# EAGLE schematic stm32 v0.9 (EAGLE 9.6.2)
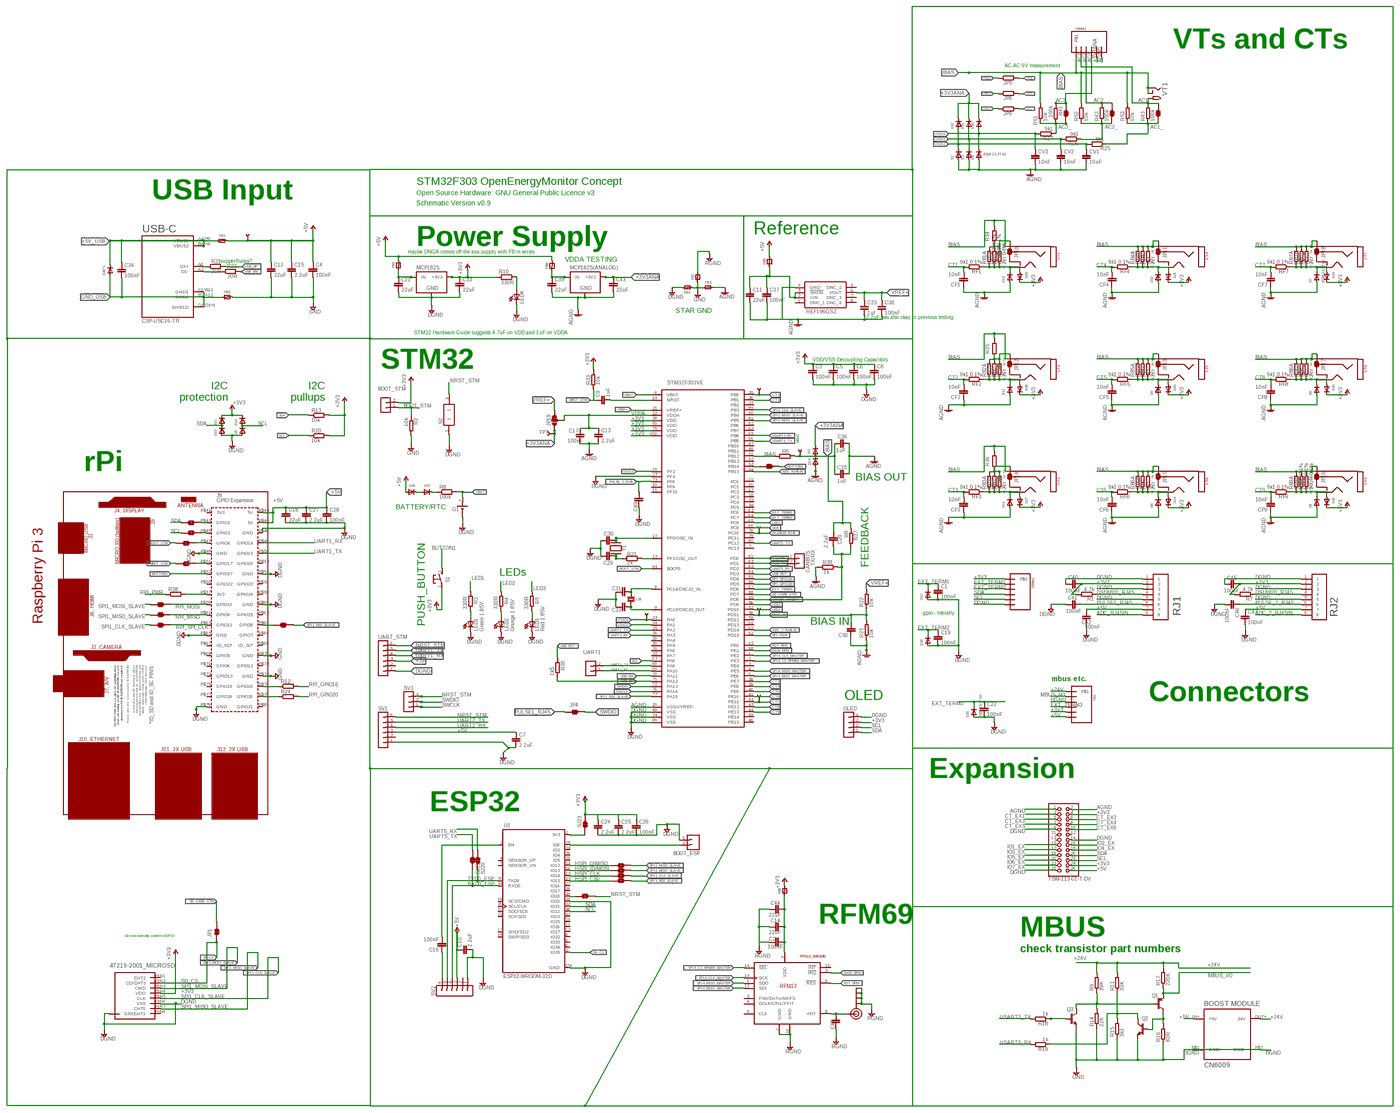
[diagram p0: schematic, sheet 1, overview]
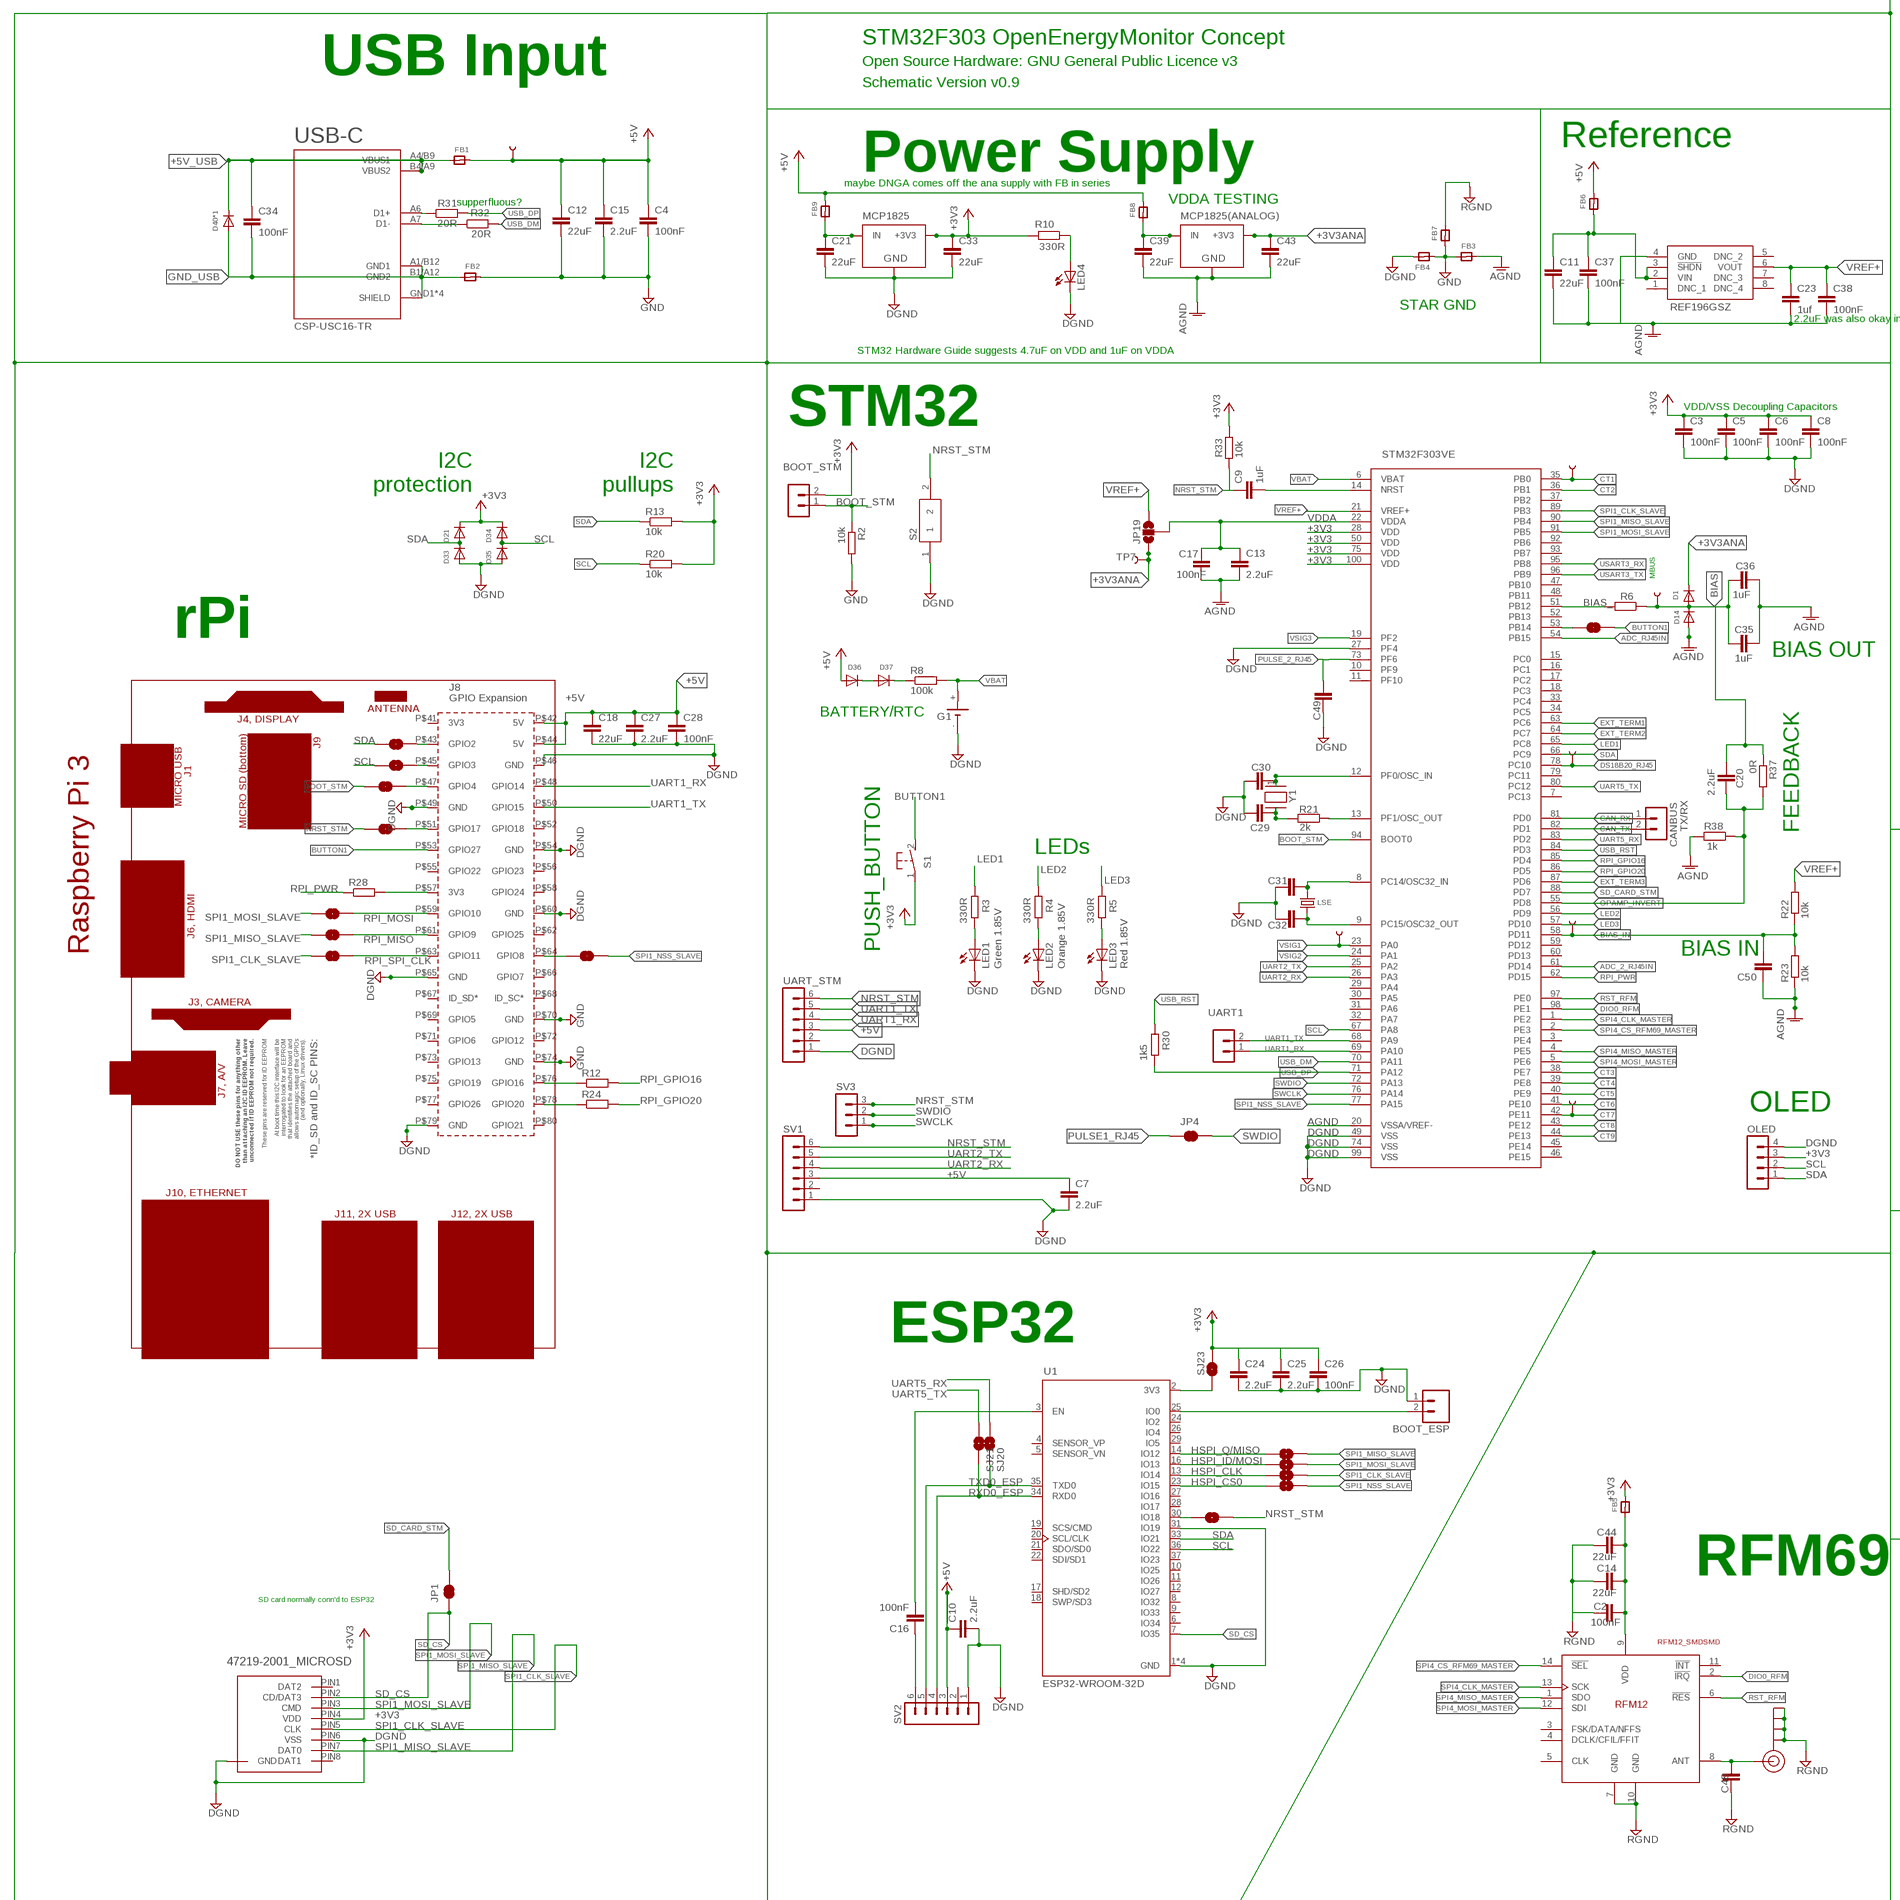
[diagram p1: schematic, sheet 1, part 1 of 4]
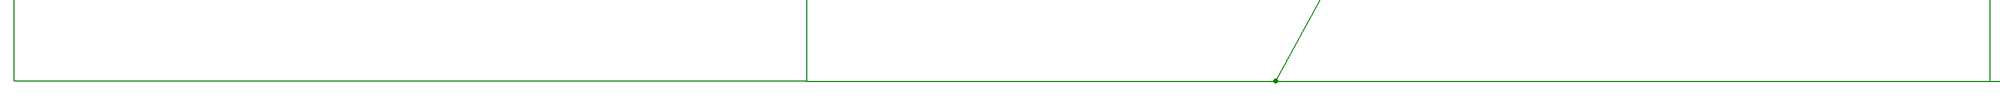
[diagram p2: schematic, sheet 1, part 2 of 4]
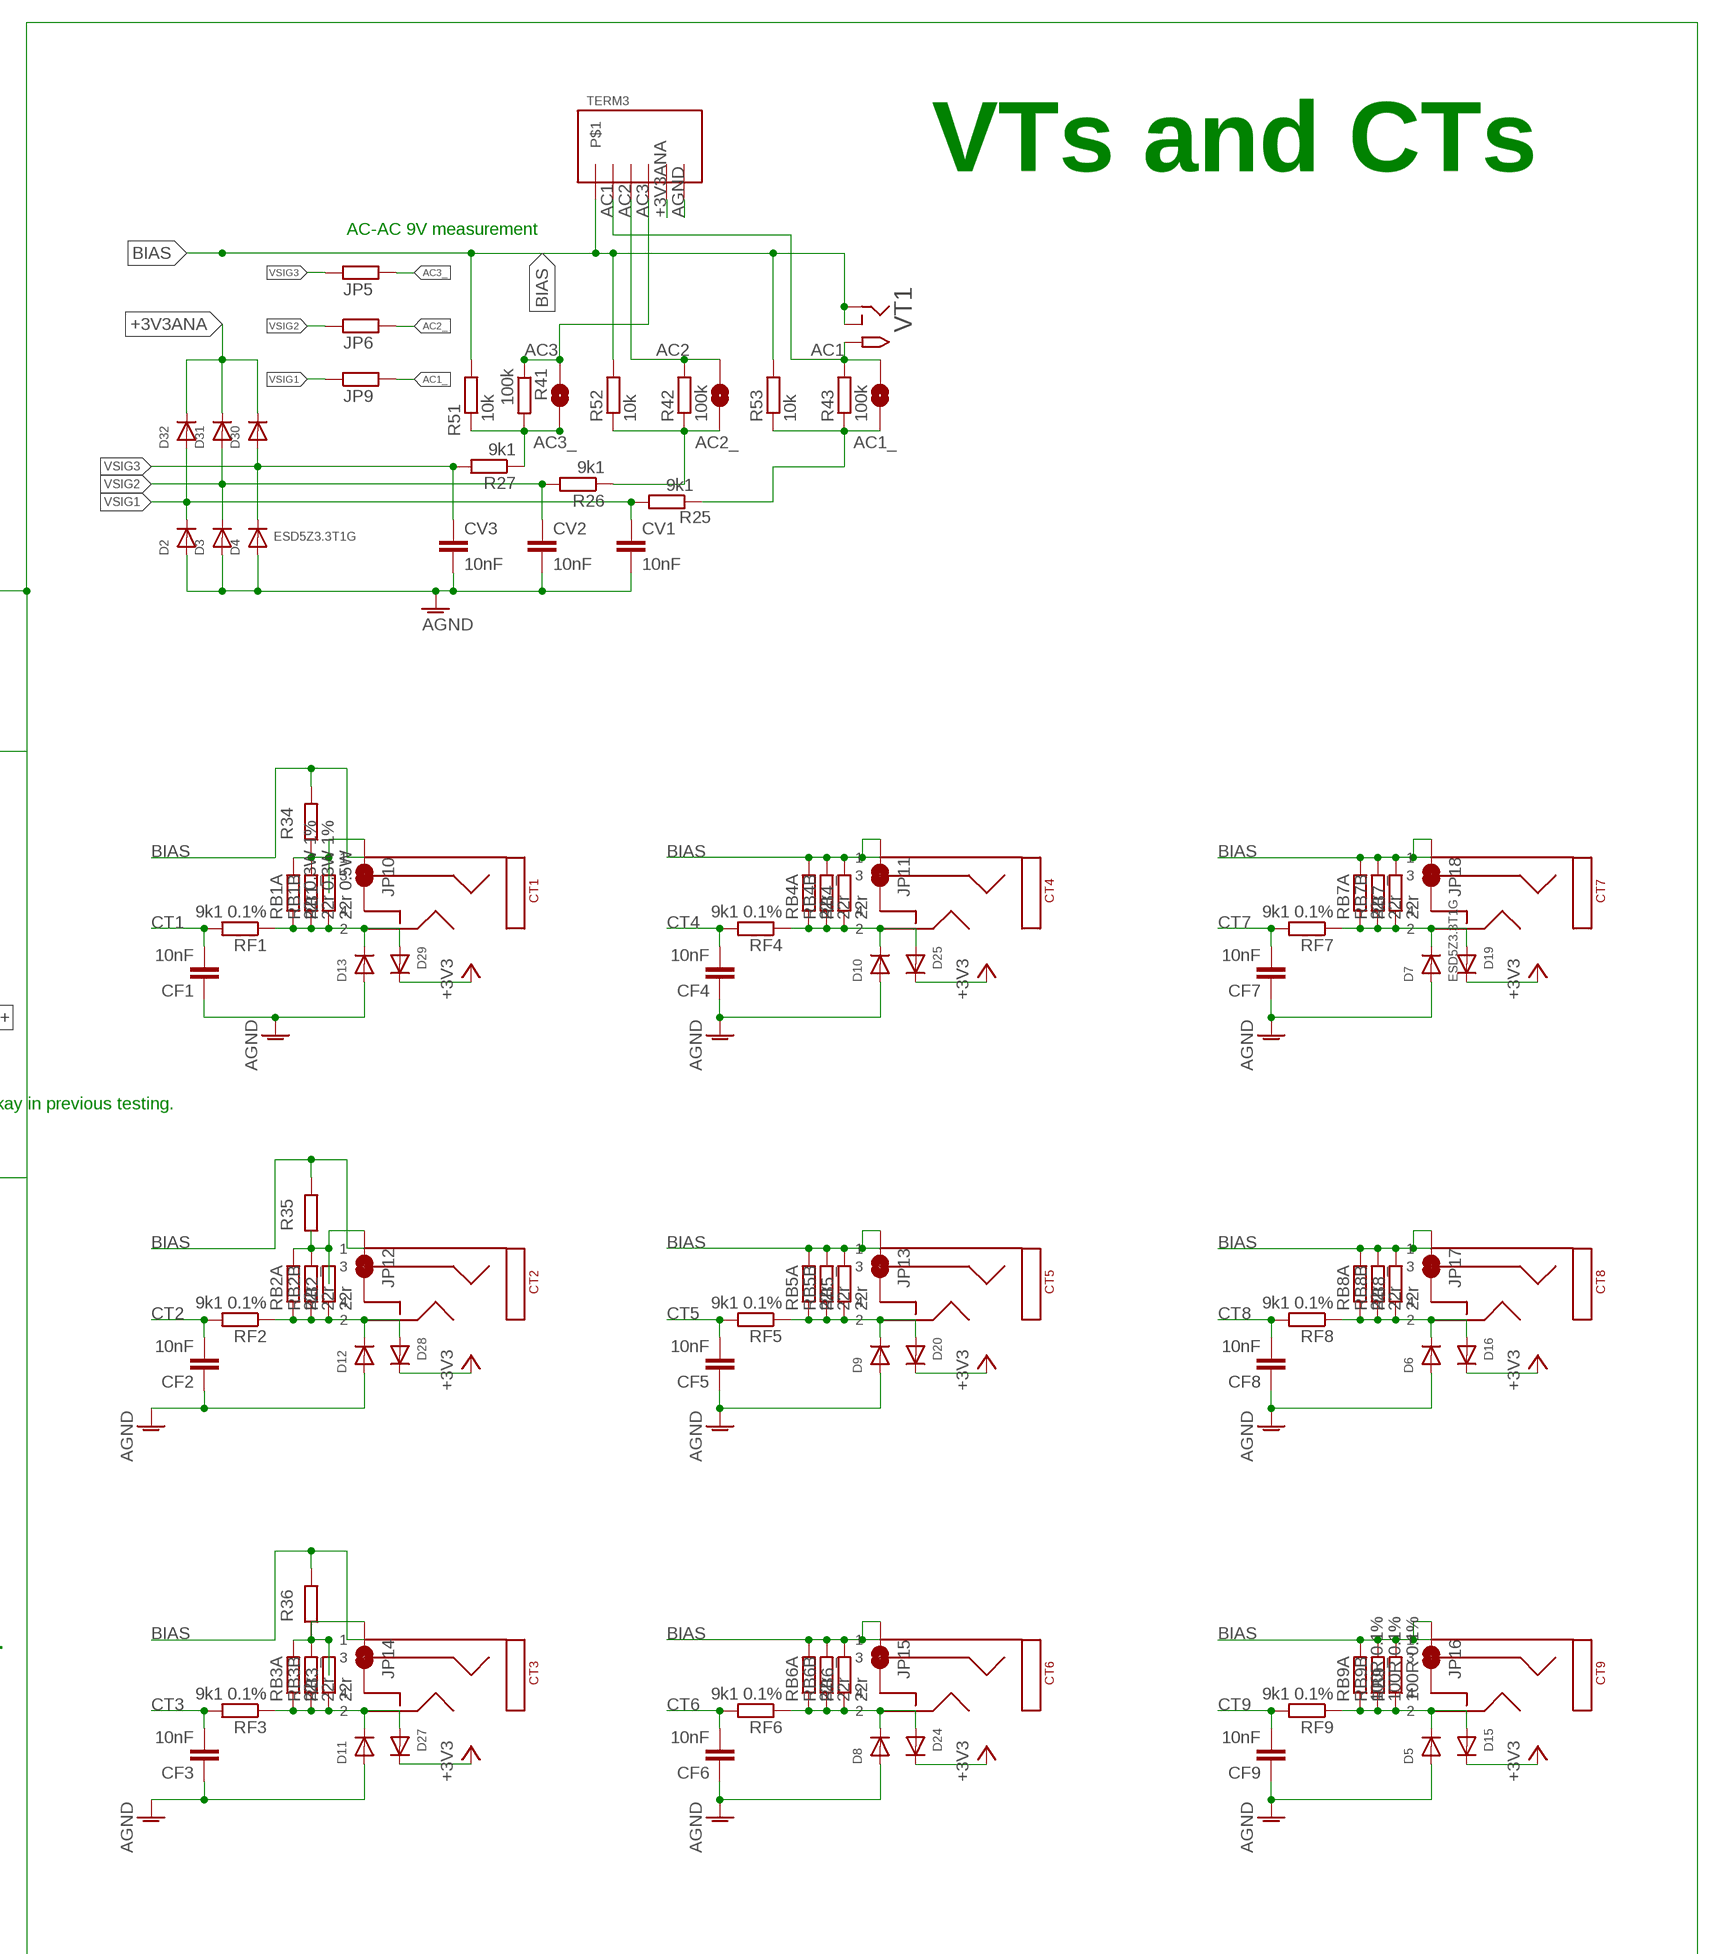
[diagram p3: schematic, sheet 1, part 3 of 4]
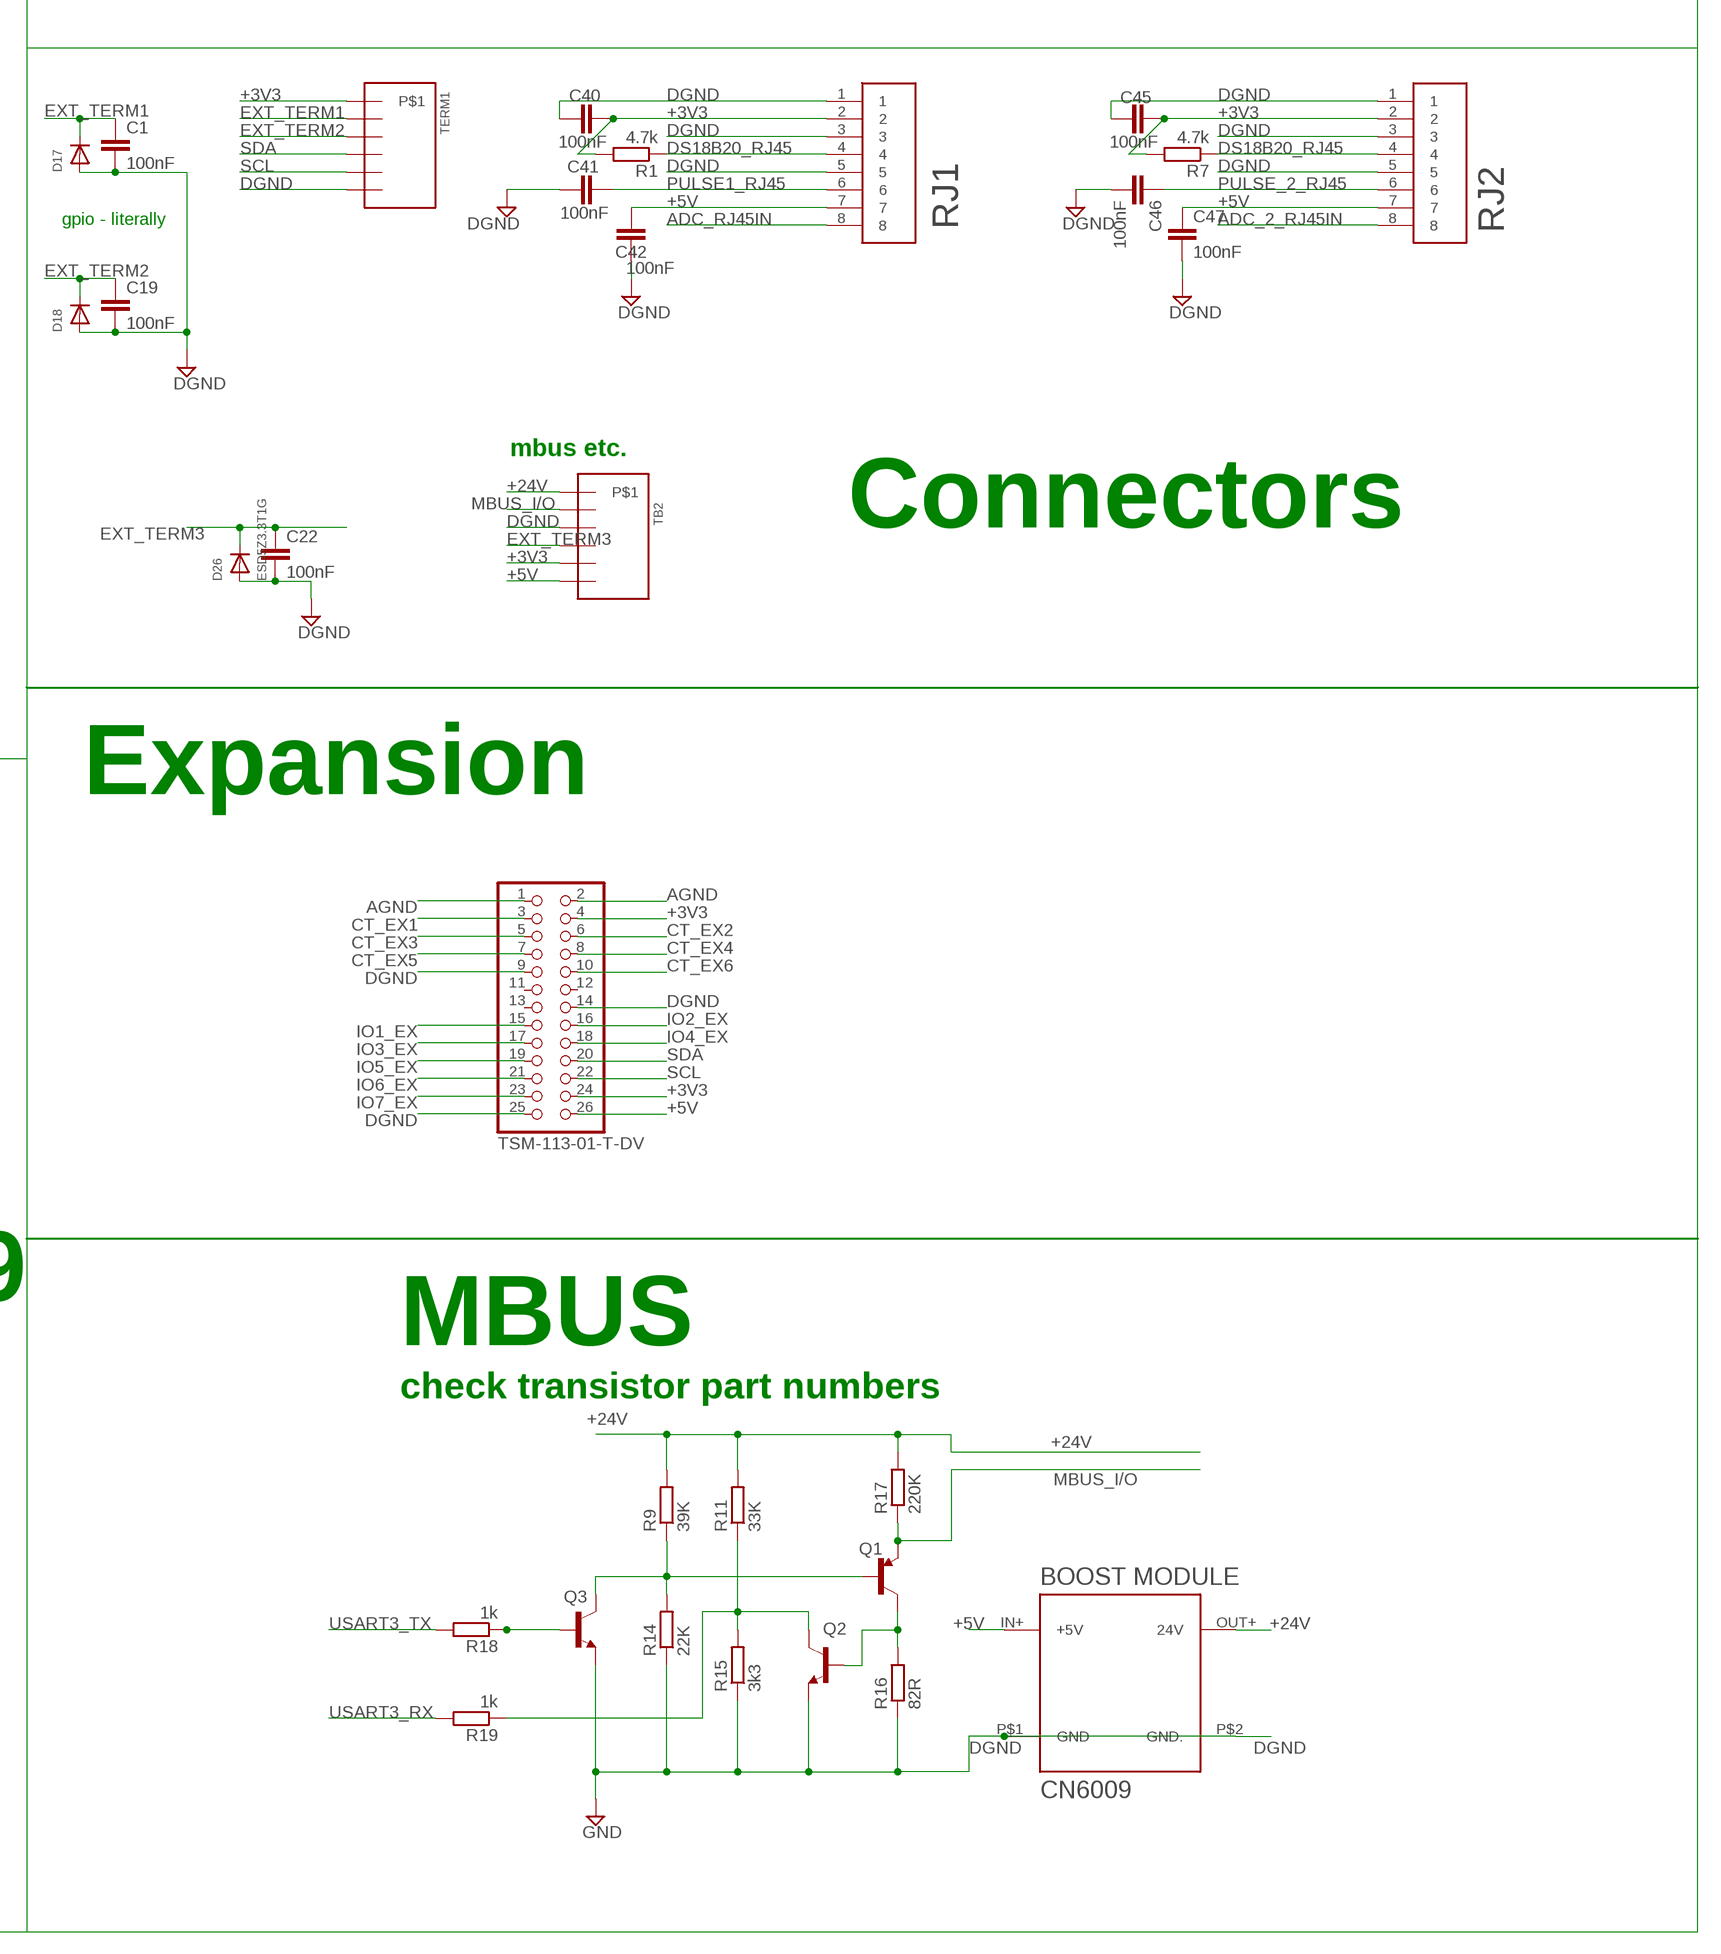
[diagram p4: schematic, sheet 1, part 4 of 4]

## Parts
BOOT_ESP  M02PTH  [1X02]
BOOT_STM  MA02-1  [MA02-1]
C1  100nF  C-EUC0603  [C0603]
C2  100nF  C-EUC0603  [C0603]
C3  100nF  C-EUC0603  [C0603]
C4  100nF  C-EUC0603  [C0603]
C5  100nF  C-EUC0603  [C0603]
C6  100nF  C-EUC0603  [C0603]
C7  2.2uF  C-EUC0805  [C0805]
C8  100nF  C-EUC0603  [C0603]
C9  1uF  C-EUC0603  [C0603]
C10  2.2uF  C-EUC0805  [C0805]
C11  22uF  C-EUC0805  [C0805]
C12  22uF  C-EUC0805  [C0805]
C13  2.2uF  C-EUC0603  [C0603]
C14  22uF  C-EUC0805  [C0805]
C15  2.2uF  C-EUC0805  [C0805]
C16  100nF  C-EUC0603  [C0603]
C17  100nF  C-EUC0603  [C0603]
C18  22uF  C-EUC0805  [C0805]
C19  100nF  C-EUC0603  [C0603]
C20  2.2uF  C-EUC0603  [C0603]
C21  22uF  C-EUC0805  [C0805]
C22  100nF  C-EUC0603  [C0603]
C23  1uf  C-EUC0603  [C0603]
C24  2.2uF  C-EUC0805  [C0805]
C25  2.2uF  C-EUC0805  [C0805]
C26  100nF  C-EUC0603  [C0603]
C27  2.2uF  C-EUC0805  [C0805]
C28  100nF  C-EUC0603  [C0603]
C29  15pF  C-EUC0603  [C0603]
C30  15pF  C-EUC0603  [C0603]
C31  10pF  C-EUC0805  [C0805]
C32  10pF  C-EUC0805  [C0805]
C33  22uF  C-EUC0805  [C0805]
C34  100nF  C-EUC0603  [C0603]
C35  1uF  C-EUC0603  [C0603]
C36  1uF  C-EUC0603  [C0603]
C37  100nF  C-EUC0603  [C0603]
C38  100nF  C-EUC0603  [C0603]
C39  22uF  C-EUC0805  [C0805]
C40  100nF  C-EUC0603  [C0603]
C41  100nF  C-EUC0603  [C0603]
C42  100nF  C-EUC0603  [C0603]
C43  22uF  C-EUC0805  [C0805]
C44  22uF  C-EUC0805  [C0805]
C45  100nF  C-EUC0603  [C0603]
C46  100nF  C-EUC0603  [C0603]
C47  100nF  C-EUC0603  [C0603]
C48  100nF  C-EUC0603  [C0603]
C49  10pF  C-EUC0805  [C0805]
C50  C-EUC0603  [C0603]
CANBUS  TX/RX  MA02-1  [MA02-1]
CF1  10nF  C-EUC0805  [C0805]
CF2  10nF  C-EUC0805  [C0805]
CF3  10nF  C-EUC0805  [C0805]
CF4  10nF  C-EUC0805  [C0805]
CF5  10nF  C-EUC0805  [C0805]
CF6  10nF  C-EUC0805  [C0805]
CF7  10nF  C-EUC0805  [C0805]
CF8  10nF  C-EUC0805  [C0805]
CF9  10nF  C-EUC0805  [C0805]
CT1  SJ-3523-SMT  SJ-3523-SMTSJ-352X-SMT_SERIES-1313220  [SJ-352X-SMT]
CT2  SJ-3523-SMT  SJ-3523-SMTSJ-352X-SMT_SERIES-1313220  [SJ-352X-SMT]
CT3  SJ-3523-SMT  SJ-3523-SMTSJ-352X-SMT_SERIES-1313220  [SJ-352X-SMT]
CT4  SJ-3523-SMT  SJ-3523-SMTSJ-352X-SMT_SERIES-1313220  [SJ-352X-SMT]
CT5  SJ-3523-SMT  SJ-3523-SMTSJ-352X-SMT_SERIES-1313220  [SJ-352X-SMT]
CT6  SJ-3523-SMT  SJ-3523-SMTSJ-352X-SMT_SERIES-1313220  [SJ-352X-SMT]
CT7  SJ-3523-SMT  SJ-3523-SMTSJ-352X-SMT_SERIES-1313220  [SJ-352X-SMT]
CT8  SJ-3523-SMT  SJ-3523-SMTSJ-352X-SMT_SERIES-1313220  [SJ-352X-SMT]
CT9  SJ-3523-SMT  SJ-3523-SMTSJ-352X-SMT_SERIES-1313220  [SJ-352X-SMT]
CV1  10nF  C-EUC0805  [C0805]
CV2  10nF  C-EUC0805  [C0805]
CV3  10nF  C-EUC0805  [C0805]
D1  ESD5Z3.3T1G  DIODESOD-523  [SOD-523]
D2  ESD5Z3.3T1G  DIODESOD-523  [SOD-523]
D3  ESD5Z3.3T1G  DIODESOD-523  [SOD-523]
D4  ESD5Z3.3T1G  DIODESOD-523  [SOD-523]
D5  ESD5Z3.3T1G  DIODESOD-523  [SOD-523]
D6  ESD5Z3.3T1G  DIODESOD-523  [SOD-523]
D7  ESD5Z3.3T1G  DIODESOD-523  [SOD-523]
D8  ESD5Z3.3T1G  DIODESOD-523  [SOD-523]
D9  ESD5Z3.3T1G  DIODESOD-523  [SOD-523]
D10  ESD5Z3.3T1G  DIODESOD-523  [SOD-523]
D11  ESD5Z3.3T1G  DIODESOD-523  [SOD-523]
D12  ESD5Z3.3T1G  DIODESOD-523  [SOD-523]
D13  ESD5Z3.3T1G  DIODESOD-523  [SOD-523]
D14  ESD5Z3.3T1G  DIODESOD-523  [SOD-523]
D15  ESD5Z3.3T1G  DIODESOD-523  [SOD-523]
D16  ESD5Z3.3T1G  DIODESOD-523  [SOD-523]
D17  ESD5Z3.3T1G  DIODESOD-523  [SOD-523]
D18  ESD5Z3.3T1G  DIODESOD-523  [SOD-523]
D19  ESD5Z3.3T1G  DIODESOD-523  [SOD-523]
D20  ESD5Z3.3T1G  DIODESOD-523  [SOD-523]
D21  ESD5Z3.3T1G  DIODESOD-523  [SOD-523]
D24  ESD5Z3.3T1G  DIODESOD-523  [SOD-523]
D25  ESD5Z3.3T1G  DIODESOD-523  [SOD-523]
D26  ESD5Z3.3T1G  DIODESOD-523  [SOD-523]
D27  ESD5Z3.3T1G  DIODESOD-523  [SOD-523]
D28  ESD5Z3.3T1G  DIODESOD-523  [SOD-523]
D29  ESD5Z3.3T1G  DIODESOD-523  [SOD-523]
D30  ESD5Z3.3T1G  DIODESOD-523  [SOD-523]
D31  ESD5Z3.3T1G  DIODESOD-523  [SOD-523]
D32  ESD5Z3.3T1G  DIODESOD-523  [SOD-523]
D33  ESD5Z3.3T1G  DIODESOD-523  [SOD-523]
D34  ESD5Z3.3T1G  DIODESOD-523  [SOD-523]
D35  ESD5Z3.3T1G  DIODESOD-523  [SOD-523]
D36  ESD5Z3.3T1G  DIODESOD-523  [SOD-523]
D37  ESD5Z3.3T1G  DIODESOD-523  [SOD-523]
D40*1  ESD5Z5.0T1G  DIODESOD-523  [SOD-523]
EXPANSION  TSM-113-01-T-DV  PINHD-2X13SMT  [2X13_SMT]
FB1  FERRITE  [0603]
FB2  FERRITE  [0603]
FB3  FERRITE_0603  [_0603]
FB4  FERRITE_0603  [_0603]
FB5  FERRITE_0603  [_0603]
FB6  FERRITE_0603  [_0603]
FB7  FERRITE_0603  [_0603]
FB8  FERRITE_0603  [_0603]
FB9  FERRITE_0603  [_0603]
G1  CH291-1220LF  [CH291-1220LF]
J1  SOLDERJUMPERNO  [SJ_2S-NO]
J$1  SMA_EDGE  [SMA-EDGE]
JP1  JUMPER-SMT_2_NC_TRACE_NO-SILK  [SMT-JUMPER_2_NC_TRACE_NO-SILK]
JP4  JUMPER-SMT_2_NC_TRACE_NO-SILK  [SMT-JUMPER_2_NC_TRACE_NO-SILK]
JP5  0R  R-EU_R0603  [R0603]
JP6  0R  R-EU_R0603  [R0603]
JP9  0R  R-EU_R0603  [R0603]
JP10  JUMPER-SMT_2_NO_NO-SILK_ROUND  [SMT-JUMPER_2_NO_NO-SILK_ROUND]
JP11  JUMPER-SMT_2_NO_NO-SILK_ROUND  [SMT-JUMPER_2_NO_NO-SILK_ROUND]
JP12  JUMPER-SMT_2_NO_NO-SILK_ROUND  [SMT-JUMPER_2_NO_NO-SILK_ROUND]
JP13  JUMPER-SMT_2_NO_NO-SILK_ROUND  [SMT-JUMPER_2_NO_NO-SILK_ROUND]
JP14  JUMPER-SMT_2_NO_NO-SILK_ROUND  [SMT-JUMPER_2_NO_NO-SILK_ROUND]
JP15  JUMPER-SMT_2_NO_NO-SILK_ROUND  [SMT-JUMPER_2_NO_NO-SILK_ROUND]
JP16  JUMPER-SMT_2_NO_NO-SILK_ROUND  [SMT-JUMPER_2_NO_NO-SILK_ROUND]
JP17  JUMPER-SMT_2_NO_NO-SILK_ROUND  [SMT-JUMPER_2_NO_NO-SILK_ROUND]
JP18  JUMPER-SMT_2_NO_NO-SILK_ROUND  [SMT-JUMPER_2_NO_NO-SILK_ROUND]
JP19  JUMPER-SMT_3_NO_NO-SILK  [SMT-JUMPER_3_NO_NO-SILK]
LED1  Green 1.85V  LEDCHIP-LED0805  [CHIP-LED0805]
LED2  Orange 1.85V  LEDCHIP-LED0805  [CHIP-LED0805]
LED3  Red 1.85V  LEDCHIP-LED0805  [CHIP-LED0805]
LED4  Green 1.85V  LEDCHIP-LED0805  [CHIP-LED0805]
LSE  32.768kHz  CRYSTAL8X3.8SMT  [CRYSTAL_8X3.8]
MCP1825  MCP1825SOT-223-3  [SOT-223]
MCP1825(ANALOG)  MCP1825SOT-223-3  [SOT-223]
OLED  MA04-1-OLEDOLED  [MA04-1-OLED]
PCB2  RPI3YA  [RPI3MIRROR2]
PS1  LT1461AIS8-3.3#PBF  [SOIC127P599X175-8N]
Q1  TRANSISTOR_PNPSOT23-REFLOW  [SOT23-R]
Q2  TRANSISTOR_NPN  [SOT23-R]
Q3  TRANSISTOR_NPN  [SOT23-R]
R1  4.7k  R-EU_R0603  [R0603]
R2  10k  R-EU_R0603  [R0603]
R3  330R  R-EU_R0603  [R0603]
R4  330R  R-EU_R0603  [R0603]
R5  330R  R-EU_R0603  [R0603]
R6  0R  R-EU_R0603  [R0603]
R7  4.7k  R-EU_R0603  [R0603]
R8  100k  R-EU_R0603  [R0603]
R9  39K  R-EU_R0603  [R0603]
R10  330R  R-EU_R0603  [R0603]
R11  33K  R-EU_R0603  [R0603]
R12  10K  R-EU_R0603  [R0603]
R13  10k  R-EU_R0603  [R0603]
R14  22K  R-EU_R0603  [R0603]
R15  3k3  R-EU_R0603  [R0603]
R16  82R  R-EU_R0603  [R0603]
R17  220K  R-EU_R0603  [R0603]
R18  1k  R-EU_R0603  [R0603]
R19  1k  R-EU_R0603  [R0603]
R20  10k  R-EU_R0603  [R0603]
R21  2k  R-EU_R0603  [R0603]
R22  10k  R-EU_R0603  [R0603]
R23  10k  R-EU_R0603  [R0603]
R24  10K  R-EU_R0603  [R0603]
R25  9k1  R-EU_R0603  [R0603]
R26  9k1  R-EU_R0603  [R0603]
R27  9k1  R-EU_R0603  [R0603]
R28  10K  R-EU_R0603  [R0603]
R30  1k5  R-EU_R0603  [R0603]
R31  20R  R-EU_R0603  [R0603]
R32  20R  R-EU_R0603  [R0603]
R33  10k  R-EU_R0603  [R0603]
R34  0R  R-EU_R0603  [R0603]
R35  0R  R-EU_R0603  [R0603]
R36  0R  R-EU_R0603  [R0603]
R37  0R  R-EU_R0603  [R0603]
R38  1k  R-EU_R0603  [R0603]
R41  100k  R-EU_R0603  [R0603]
R42  100k  R-EU_R0603  [R0603]
R43  100k  R-EU_R0603  [R0603]
R51  10k  R-EU_R0603  [R0603]
R52  10k  R-EU_R0603  [R0603]
R53  10k  R-EU_R0603  [R0603]
RB1_  22r 0.5W  R-EU_0207/10  [0207/10]
RB1A  22r 0.3W 1%  R-EU_R0805  [R0805]
RB1B  22r 0.3W 1%  R-EU_R0805  [R0805]
RB2_  22r  R-EU_0207/10  [0207/10]
RB2A  22r  R-EU_R0805  [R0805]
RB2B  22r  R-EU_R0805  [R0805]
RB3_  22r  R-EU_0207/10  [0207/10]
RB3A  22r  R-EU_R0805  [R0805]
RB3B  22r  R-EU_R0805  [R0805]
RB4_  22r  R-EU_0207/10  [0207/10]
RB4A  22r  R-EU_R0805  [R0805]
RB4B  22r  R-EU_R0805  [R0805]
RB5_  22r  R-EU_0207/10  [0207/10]
RB5A  22r  R-EU_R0805  [R0805]
RB5B  22r  R-EU_R0805  [R0805]
RB6_  22r  R-EU_0207/10  [0207/10]
RB6A  22r  R-EU_R0805  [R0805]
RB6B  22r  R-EU_R0805  [R0805]
RB7_  22r  R-EU_0207/10  [0207/10]
RB7A  22r  R-EU_R0805  [R0805]
RB7B  22r  R-EU_R0805  [R0805]
RB8_  22r  R-EU_0207/10  [0207/10]
RB8A  22r  R-EU_R0805  [R0805]
RB8B  22r  R-EU_R0805  [R0805]
RB9_  100R 0.1%  R-EU_0207/10  [0207/10]
RB9A  100R 0.1%  R-EU_R0805  [R0805]
RB9B  100R 0.1%  R-EU_R0805  [R0805]
RF1  9k1 0.1%  R-EU_R0603  [R0603]
RF2  9k1 0.1%  R-EU_R0603  [R0603]
RF3  9k1 0.1%  R-EU_R0603  [R0603]
RF4  9k1 0.1%  R-EU_R0603  [R0603]
RF5  9k1 0.1%  R-EU_R0603  [R0603]
RF6  9k1 0.1%  R-EU_R0603  [R0603]
RF7  9k1 0.1%  R-EU_R0603  [R0603]
RF8  9k1 0.1%  R-EU_R0603  [R0603]
RF9  9k1 0.1%  R-EU_R0603  [R0603]
RFM69HCW  RFM12_SMDSMD  [RFM12]
RJ1  95501-6889  [955016889]
RJ2  95501-6889  [955016889]
S1  31-XX  [B3F-31XX]
S2  KSS221GLFS  [KSS]
SJ3  SOLDERJUMPERNO  [SJ_2S-NO]
SJ4  JUMPER-SMT_2_NO_SILK  [SMT-JUMPER_2_NO_SILK]
SJ5  SOLDERJUMPERNO  [SJ_2S-NO]
SJ6  SOLDERJUMPERNO  [SJ_2S-NO]
SJ7  SOLDERJUMPERNO  [SJ_2S-NO]
SJ9  JUMPER-SMT_2_NO_SILK  [SMT-JUMPER_2_NO_SILK]
SJ10  JUMPER-SMT_2_NO_SILK  [SMT-JUMPER_2_NO_SILK]
SJ13  JUMPER-SMT_2_NO_SILK  [SMT-JUMPER_2_NO_SILK]
SJ14  SOLDERJUMPERNO  [SJ_2S-NO]
SJ20  SOLDERJUMPERNO  [SJ_2S-NO]
SJ21  SOLDERJUMPERNO  [SJ_2S-NO]
SJ23  SOLDERJUMPERNO  [SJ_2S-NO]
SJ25  SOLDERJUMPERNO  [SJ_2S-NO]
SJ26  SOLDERJUMPERNO  [SJ_2S-NO]
SJ27  SOLDERJUMPERNO  [SJ_2S-NO]
SJ32  SOLDERJUMPERNO  [SJ_2S-NO]
SJ35  SOLDERJUMPERNO  [SJ_2S-NO]
SJ36  SOLDERJUMPERNO  [SJ_2S-NO]
SJ37  SOLDERJUMPERNO  [SJ_2S-NO]
STM32F303VE  STM32F303VE  STM32F303XB  [TQFP100]
SV1  MA06-1  [MA06-1]
SV2  MA06-1  [MA06-1]
SV3  MA03-1  [MA03-1]
TB2  3.5MM_TB_X6  [3.5MM_X6]
TERM1  3.5MM_TB_X6  [3.5MM_X6]
TERM3  3.5MM_TB_X6  [3.5MM_X6]
TP4  TEST-POINTPOGO_PTH  [1X01_NO_SILK]
TP5  TEST-POINTPOGO_PTH  [1X01_NO_SILK]
TP7  TEST-POINTPOGO_PTH  [1X01_NO_SILK]
TP9  TEST-POINTPOGO_PTH  [1X01_NO_SILK]
TP10  TEST-POINTPOGO_PTH  [1X01_NO_SILK]
TP18  TEST-POINTPOGO_PTH  [1X01_NO_SILK]
TP19  TEST-POINTPOGO_PTH  [1X01_NO_SILK]
TP20  TEST-POINTPOGO_PTH  [1X01_NO_SILK]
U1  ESP32-WROOM-32D  [MODULE_ESP32-WROOM-32D]
U$2  BOOST_MODULE  [BOOST]
U$7  47219-2001_MICROSD  [47219-2001_MICROSD]
UART1  MA02-1  [MA02-1]
UART_STM  MA06-1  [MA06-1]
USB-C  CSP-USC16-TR  [USB-C]
VT1  ADC-028-2-T  2.1MMJACKSMT  [DCJACK_2MM_SMT]
Y1  6MM_3.5MM_CRYSTAL  [ABMM2]

## Nets
+3V3 [power]: BOOT_STM.2 C3.1 C5.1 C6.1 C8.1 C24.1 C25.1 C26.1 C33.1 C40.1 C45.1 D21.K(C) D34.K(C) EXPANSION.4 EXPANSION.24 FB5.2 MCP1825.3(+3V3) OLED.3 R1.2 R7.2 R10.2 R13.2 R20.2 R33.1 RJ1.2 RJ2.2 S1.1(P) SJ23.2 STM32F303VE.28(VDD) STM32F303VE.50(VDD) STM32F303VE.75(VDD) STM32F303VE.100(VDD) TB2.P$5 TERM1.P$1 U$7.PIN4(VDD)
+3V3ANA [power]: C43.1 D1.K(C) D15.K(C) D16.K(C) D19.K(C) D20.K(C) D24.K(C) D25.K(C) D27.K(C) D28.K(C) D29.K(C) D30.K(C) D31.K(C) D32.K(C) JP19.1 MCP1825(ANALOG).3(+3V3) TERM3.P$5 TP7.1 ; supply symbol labelled +3V3
+5V [power]: C4.1 C7.1 C10.1 C12.1 C15.1 C18.1 C27.1 C28.1 C42.1 C47.1 D36.A EXPANSION.26 FB1.2 FB6.2 FB8.2 FB9.2 PCB2.P$42(5V) PCB2.P$44(5V) RJ1.7 RJ2.7 SV1.3 SV2.3 TB2.P$6 TP4.1 U$2.IN+(+5V) UART_STM.3
+5V_A [power]: C39.1 FB8.1 MCP1825(ANALOG).1(IN)
+5V_D [power]: C21.1 FB9.1 MCP1825.1(IN)
+5V_REF [power]: C11.1 C37.1 FB6.1 PS1.2(VIN) PS1.3(!SHDN)
+5V_USB [power]: C34.1 D40*1.K(C) FB1.1 USB-C.A4/B9(VBUS1) USB-C.B4/A9(VBUS2)
+24V: R9.2 R11.2 R17.2 TB2.P$1 U$2.OUT+(24V)
AC1: R43.2 SJ37.2 TERM3.P$2 VT1.PWR2(TIP)
AC1_ [cts_vts]: JP9.2 R25.1 R43.1 R53.1 SJ37.1
AC2: R42.2 SJ36.2 TERM3.P$3
AC2_ [cts_vts]: JP6.2 R26.1 R42.1 R52.1 SJ36.1
AC3: R41.1 SJ35.2 TERM3.P$4
AC3_ [cts_vts]: JP5.2 R27.1 R41.2 R51.1 SJ35.1
ADC_2_RJ45IN: RJ2.8 STM32F303VE.61(PD14)
ADC_RJ45IN: RJ1.8 STM32F303VE.54(PB15)
AGND [gnd]: C11.2 C13.2 C17.2 C23.2 C35.2 C36.2 C37.2 C38.2 C39.2 C43.2 C50.1 CF1.1 CF2.1 CF3.1 CF4.1 CF5.1 CF6.1 CF7.1 CF8.1 CF9.1 CV1.2 CV2.2 CV3.2 D2.A D3.A D4.A D5.A D6.A D7.A D8.A D9.A D10.A D11.A D12.A D13.A D14.A EXPANSION.1 EXPANSION.2 FB3.2 MCP1825(ANALOG).2(GND) MCP1825(ANALOG).4(GND) PS1.4(GND) R23.1 R38.2 STM32F303VE.20(VSSA/VREF-) TERM3.P$6
ANT [ant]: C48.1 J$1.SIG(SIGNAL) RFM69HCW.8(ANT)
BIAS [cts_vts]: C20.1 C35.1 C36.1 CT1.P$1 CT2.P$1 CT3.P$1 CT4.P$1 CT5.P$1 CT6.P$1 CT7.P$1 CT8.P$1 CT9.P$1 D1.A D14.K(C) JP11.1 JP13.1 JP15.1 JP16.1 JP17.1 JP18.1 R6.1 R34.2 R35.2 R36.2 R37.1 R51.2 R52.2 R53.2 RB4_.2 RB4A.2 RB4B.2 RB5_.2 RB5A.2 RB5B.2 RB6_.2 RB6A.2 RB6B.2 RB7_.2 RB7A.2 RB7B.2 RB8_.2 RB8A.2 RB8B.2 RB9_.2 RB9A.2 RB9B.2 TERM3.P$1 TP5.1 VT1.GND(RING) VT1.GNDBREAK(RING_SW)
BIAS_ [cts_vts]: R6.2 STM32F303VE.51(PB12)
BIAS_IN: C50.2 R22.1 R23.2 STM32F303VE.58(PD11) TP10.1
BOOT0_RPI: J1.2 PCB2.P$47(GPIO4)
BOOT_STM: BOOT_STM.1 J1.1 R2.1 STM32F303VE.94(BOOT0)
BUTTON1: PCB2.P$53(GPIO27) S1.2(S) SJ3.1
BUTTON1_STM: SJ3.2 STM32F303VE.53(PB14)
CAN_RX: CANBUS.1 STM32F303VE.81(PD0)
CAN_TX: CANBUS.2 STM32F303VE.82(PD1)
CT1 [cts_vts]: CF1.2 RF1.2 STM32F303VE.35(PB0) TP18.1
CT2 [cts_vts]: CF2.2 RF2.2 STM32F303VE.36(PB1)
CT3 [cts_vts]: CF3.2 RF3.2 STM32F303VE.38(PE7)
CT4 [cts_vts]: CF4.2 RF4.2 STM32F303VE.39(PE8)
CT5 [cts_vts]: CF5.2 RF5.2 STM32F303VE.40(PE9)
CT6 [cts_vts]: CF6.2 RF6.2 STM32F303VE.41(PE10)
CT7 [cts_vts]: CF7.2 RF7.2 STM32F303VE.42(PE11) TP19.1
CT8 [cts_vts]: CF8.2 RF8.2 STM32F303VE.43(PE12)
CT9 [cts_vts]: CF9.2 RF9.2 STM32F303VE.44(PE13)
CT_EX1: EXPANSION.3
CT_EX2: EXPANSION.6
CT_EX3: EXPANSION.5
CT_EX4: EXPANSION.8
CT_EX5: EXPANSION.7
CT_EX6: EXPANSION.10
CT_IN1: CT1.P$2 D13.K(C) D29.A RB1_.1 RB1A.1 RB1B.1 RF1.1
CT_IN2: CT2.P$2 D12.K(C) D28.A RB2_.1 RB2A.1 RB2B.1 RF2.1
CT_IN3: CT3.P$2 D11.K(C) D27.A RB3_.1 RB3A.1 RB3B.1 RF3.1
CT_IN4: CT4.P$2 D10.K(C) D25.A RB4_.1 RB4A.1 RB4B.1 RF4.1
CT_IN5: CT5.P$2 D9.K(C) D20.A RB5_.1 RB5A.1 RB5B.1 RF5.1
CT_IN6: CT6.P$2 D8.K(C) D24.A RB6_.1 RB6A.1 RB6B.1 RF6.1
CT_IN7: CT7.P$2 D7.K(C) D19.A RB7_.1 RB7A.1 RB7B.1 RF7.1
CT_IN8: CT8.P$2 D6.K(C) D16.A RB8_.1 RB8A.1 RB8B.1 RF8.1
CT_IN9: CT9.P$2 D5.K(C) D15.A RB9_.1 RB9A.1 RB9B.1 RF9.1
DGND [gnd]: BOOT_ESP.1 C1.2 C3.2 C5.2 C6.2 C7.2 C8.2 C10.2 C18.2 C19.2 C21.2 C22.2 C24.2 C25.2 C26.2 C27.2 C28.2 C29.2 C30.2 C31.2 C32.2 C33.2 C40.2 C41.2 C42.2 C45.2 C46.2 C47.2 C49.2 D17.A D18.A D26.A D33.A D35.A EXPANSION.9 EXPANSION.14 EXPANSION.25 FB4.2 G1.- LED1.C LED2.C LED3.C LED4.C MCP1825.2(GND) MCP1825.4(GND) OLED.4 PCB2.P$46(GND) PCB2.P$49(GND) PCB2.P$54(GND) PCB2.P$60(GND) PCB2.P$65(GND) PCB2.P$70(GND) PCB2.P$74(GND) PCB2.P$79(GND) Q2.2(E) Q3.2(E) R2.2 R14.1 R15.1 R16.1 RJ1.1 RJ1.3 RJ1.5 RJ2.1 RJ2.3 RJ2.5 S2.1 STM32F303VE.27(PF4) STM32F303VE.49(VSS) STM32F303VE.74(VSS) STM32F303VE.99(VSS) SV1.1 SV2.1 TB2.P$3 TERM1.P$6 U1.1(GND) U1.15(GND) U1.31(IO19) U1.38(GND) U1.39(GND) U$2.P$1(GND) U$2.P$2(GND.) U$7.P$1(GND) U$7.P$2(GND) U$7.P$3(GND) U$7.P$4(GND) U$7.PIN6(VSS) UART_STM.1 ; supply symbol labelled GND
DIO0_RFM: RFM69HCW.2(!IRQ) STM32F303VE.98(PE1)
DS18B20_RJ45: R1.1 R7.1 RJ1.4 RJ2.4 STM32F303VE.78(PC10) TP9.1
ESP_PWR_PRE: SJ23.1 U1.2(3V3)
EXT_TERM1: C1.1 D17.K(C) STM32F303VE.63(PC6) TERM1.P$2
EXT_TERM2: C19.1 D18.K(C) STM32F303VE.64(PC7) TERM1.P$3
EXT_TERM3: C22.1 D26.K(C) STM32F303VE.87(PD6) TB2.P$4
GND [gnd]: C4.2 C12.2 C15.2 FB2.2 FB3.1 FB4.1 FB7.1
GND_USB [gnd]: C34.2 D40*1.A FB2.1 USB-C.A1/B12(GND1) USB-C.B1/A12(GND2) USB-C.GND1(SHIELD) USB-C.GND2(SHIELD) USB-C.GND3(SHIELD) USB-C.GND4(SHIELD)
HSE_IN: C30.1 STM32F303VE.12(PF0/OSC_IN) Y1.1(CRYSTAL_1)
HSE_OUT: R21.1 STM32F303VE.13(PF1/OSC_OUT)
HSE_OUT_: C29.1 R21.2 Y1.3(CRYSTAL_2)
HSPI_CLK: SJ10.1 U1.13(IO14)
HSPI_CS0: SJ13.1 U1.23(IO15)
HSPI_ID/MOSI: SJ9.1 U1.16(IO13)
HSPI_Q/MISO: SJ4.1 U1.14(IO12)
IO1_EX: EXPANSION.15
IO2_EX: EXPANSION.16
IO3_EX: EXPANSION.17
IO4_EX: EXPANSION.18
IO5_EX: EXPANSION.19
IO6_EX: EXPANSION.21
IO7_EX: EXPANSION.23
LED1: R3.2 STM32F303VE.65(PC8)
LED2: R4.2 STM32F303VE.56(PD9)
LED3: R5.2 STM32F303VE.57(PD10)
MBUS_I/O: Q1.2(E) R17.1 TB2.P$2
N$1: CT1.P$4 JP10.2
N$2: CT4.P$4 JP11.2
N$5: LED2.A R4.1
N$6: LED3.A R5.1
N$8: CT2.P$4 JP12.2
N$9: LED4.A R10.1
N$10: CT5.P$4 JP13.2
N$11: PCB2.P$64(GPIO8) SJ14.1
N$13: CT3.P$4 JP14.2
N$14: C16.1 SV2.6
N$15: C16.2 U1.3(EN)
N$16: D36.K(C) D37.A
N$17: BOOT_ESP.2 U1.25(IO0)
N$18: PCB2.P$57(3V3) R28.2
N$19: D37.K(C) R8.1
N$20: CT6.P$4 JP15.2
N$21: CT9.P$4 JP16.2
N$22: CT8.P$4 JP17.2
N$23: CT7.P$4 JP18.2
N$26: JP10.1 R34.1 RB1_.2 RB1A.2 RB1B.2
N$27: JP12.1 R35.1 RB2_.2 RB2A.2 RB2B.2
N$28: JP14.1 R36.1 RB3_.2 RB3A.2 RB3B.2
N$30: Q1.3(C) Q2.1(B) R16.2
N$31: Q1.1(B) Q3.3(C) R9.1 R14.2
N$32: Q2.3(C) R11.1 R15.2 R19.1
N$33: Q3.1(B) R18.1
N$41: LED1.A R3.1
NRST_STM: C9.1 R33.2 S2.2 SJ25.2 SJ32.1 SV1.6 SV3.3 UART_STM.6
NRST_STM_: C9.2 STM32F303VE.14(NRST)
NRST_STM_ESP: SJ25.1 U1.30(IO18)
NRST_STM_RPI: PCB2.P$51(GPIO17) SJ32.2
OPAMP_INVERT-: C20.2 R37.2 R38.1 STM32F303VE.55(PD8)
PC14: C31.1 LSE.P$1 STM32F303VE.8(PC14/OSC32_IN)
PC15: C32.1 LSE.P$4 STM32F303VE.9(PC15/OSC32_OUT)
PULSE1_RJ45: C41.1 JP4.1 RJ1.6
PULSE_2_RJ45: C46.1 C49.1 RJ2.6 STM32F303VE.73(PF6)
RGND: C2.2 C14.2 C44.2 C48.2 FB7.2 J$1.GND@0(GND) J$1.GND@1(GND) J$1.GND@2(GND) J$1.GND@3(GND) RFM69HCW.7(GND) RFM69HCW.10(GND)
RPI_GPIO16: R12.2 STM32F303VE.85(PD4)
RPI_GPIO16_RPI: PCB2.P$76(GPIO16) R12.1
RPI_GPIO20: R24.2 STM32F303VE.86(PD5)
RPI_GPIO20_RPI: PCB2.P$78(GPIO20) R24.1
RPI_MISO: PCB2.P$61(GPIO9) SJ6.2
RPI_MOSI: PCB2.P$59(GPIO10) SJ5.2
RPI_PWR: R28.1 STM32F303VE.62(PD15)
RPI_SPI_CLK: PCB2.P$63(GPIO11) SJ7.2
RST_RFM: RFM69HCW.6(!RES) STM32F303VE.97(PE0)
RXD0_ESP: SJ21.2 SV2.4 U1.34(RXD0)
SCL: D34.A D35.K(C) EXPANSION.22 OLED.2 R20.1 SJ27.2 STM32F303VE.67(PA8) TERM1.P$5 U1.36(IO22)
SCL_: PCB2.P$45(GPIO3) SJ27.1
SD_CARD_STM: JP1.2 STM32F303VE.88(PD7)
SD_CS: JP1.1 U1.7(IO35) U$7.PIN2(CD/DAT3)
SDA: D21.A D33.K(C) EXPANSION.20 OLED.1 R13.1 SJ26.1 STM32F303VE.66(PC9) TERM1.P$4 U1.33(IO21)
SDA_: PCB2.P$43(GPIO2) SJ26.2
SPI1_CLK_SLAVE: SJ7.1 SJ10.2 STM32F303VE.89(PB3) U$7.PIN5(CLK)
SPI1_MISO_SLAVE: SJ4.2 SJ6.1 STM32F303VE.90(PB4) U$7.PIN7(DAT0)
SPI1_MOSI_SLAVE: SJ5.1 SJ9.2 STM32F303VE.91(PB5) U$7.PIN3(CMD)
SPI1_NSS_SLAVE: SJ13.2 SJ14.2 STM32F303VE.77(PA15)
SPI4_CLK_MASTER: RFM69HCW.13(SCK) STM32F303VE.1(PE2)
SPI4_CS_RFM69_MASTER: RFM69HCW.14(!SEL) STM32F303VE.2(PE3)
SPI4_MISO_MASTER: RFM69HCW.1(SDO) STM32F303VE.4(PE5)
SPI4_MOSI_MASTER: RFM69HCW.12(SDI) STM32F303VE.5(PE6)
SWCLK: STM32F303VE.76(PA14) SV3.1
SWDIO: JP4.2 STM32F303VE.72(PA13) SV3.2
TXD0_ESP: SJ20.2 SV2.5 U1.35(TXD0)
UART1_RX: PCB2.P$48(GPIO14) STM32F303VE.69(PA10) UART1.1 UART_STM.4
UART1_TX: PCB2.P$50(GPIO15) STM32F303VE.68(PA9) UART1.2 UART_STM.5
UART2_RX: STM32F303VE.26(PA3) SV1.4
UART2_TX: STM32F303VE.25(PA2) SV1.5
UART5_RX: SJ20.1 STM32F303VE.83(PD2)
UART5_TX: SJ21.1 STM32F303VE.80(PC12)
USART3_RX: R19.2 STM32F303VE.95(PB8)
USART3_TX: R18.2 STM32F303VE.96(PB9)
USB_DM: R32.2 STM32F303VE.70(PA11)
USB_DM_: R32.1 USB-C.A7(D1-)
USB_DP: R30.1 R31.2 STM32F303VE.71(PA12)
USB_DP_: R31.1 USB-C.A6(D1+)
USB_RST: R30.2 STM32F303VE.84(PD3)
VBAT: G1.+ R8.2 STM32F303VE.6(VBAT)
VDD [power]: C2.1 C14.1 C44.1 FB5.1 RFM69HCW.9(VDD)
VDDA [power]: C13.1 C17.1 JP19.2 STM32F303VE.22(VDDA)
VREF+: C23.1 C38.1 JP19.3 PS1.6(VOUT) R22.2 STM32F303VE.21(VREF+)
VSIG1 [cts_vts]: CV1.1 D2.K(C) D32.A JP9.1 R25.2 STM32F303VE.23(PA0) TP20.1
VSIG2 [cts_vts]: CV2.1 D3.K(C) D31.A JP6.1 R26.2 STM32F303VE.24(PA1)
VSIG3 [cts_vts]: CV3.1 D4.K(C) D30.A JP5.1 R27.2 STM32F303VE.19(PF2)
Unconnected: CT1.P$3 CT2.P$3 CT3.P$3 CT4.P$3 CT5.P$3 CT6.P$3 CT7.P$3 CT8.P$3 CT9.P$3 EXPANSION.11 EXPANSION.12 EXPANSION.13 PCB2.P$41(3V3) PCB2.P$52(GPIO18) PCB2.P$55(GPIO22) PCB2.P$56(GPIO23) PCB2.P$58(GPIO24) PCB2.P$62(GPIO25) PCB2.P$66(GPIO7) PCB2.P$67(ID_SD*) PCB2.P$68(ID_SC*) PCB2.P$69(GPIO5) PCB2.P$71(GPIO6) PCB2.P$72(GPIO12) PCB2.P$73(GPIO13) PCB2.P$75(GPIO19) PCB2.P$77(GPIO26) PCB2.P$80(GPIO21) PS1.1(DNC_1) PS1.5(DNC_2) PS1.7(DNC_3) PS1.8(DNC_4) RFM69HCW.3(FSK/DATA/NFFS) RFM69HCW.4(DCLK/CFIL/FFIT) RFM69HCW.5(CLK) RFM69HCW.11(!INT) STM32F303VE.3(PE4) STM32F303VE.7(PC13) STM32F303VE.10(PF9) STM32F303VE.11(PF10) STM32F303VE.15(PC0) STM32F303VE.16(PC1) STM32F303VE.17(PC2) STM32F303VE.18(PC3) STM32F303VE.29(PA4) STM32F303VE.30(PA5) STM32F303VE.31(PA6) STM32F303VE.32(PA7) STM32F303VE.33(PC4) STM32F303VE.34(PC5) STM32F303VE.37(PB2) STM32F303VE.45(PE14) STM32F303VE.46(PE15) STM32F303VE.47(PB10) STM32F303VE.48(PB11) STM32F303VE.52(PB13) STM32F303VE.59(PD12) STM32F303VE.60(PD13) STM32F303VE.79(PC11) STM32F303VE.92(PB6) STM32F303VE.93(PB7) SV1.2 SV2.2 U1.4(SENSOR_VP) U1.5(SENSOR_VN) U1.6(IO34) U1.8(IO32) U1.9(IO33) U1.10(IO25) U1.11(IO26) U1.12(IO27) U1.17(SHD/SD2) U1.18(SWP/SD3) U1.19(SCS/CMD) U1.20(SCL/CLK) U1.21(SDO/SD0) U1.22(SDI/SD1) U1.24(IO2) U1.26(IO4) U1.27(IO16) U1.28(IO17) U1.29(IO5) U1.37(IO23) U$7.PIN1(DAT2) U$7.PIN8(DAT1) UART_STM.2

## Notes on the sheet
- VTs and CTs
- AC-AC 9V measurement
- USB Input
- STM32F303 OpenEnergyMonitor Concept
- Open Source Hardware: GNU General Public Licence v3
- Schematic Version v0.9
- Reference
- Power Supply
- maybe DNGA comes off the ana supply with FB in series
- VDDA TESTING
- supperfluous?
- STAR GND
- 2.2uF was also okay in previous testing.
- STM32 Hardware Guide suggests 4.7uF on VDD and 1uF on VDDA
- VDD/VSS Decoupling Capacitors
- STM32
- I2C
  protection
- I2C
  pullups
- MBUS
- rPi
- BIAS OUT
- FEEDBACK
- BATTERY/RTC
- PUSH_BUTTON
- LEDs
- gpio - literally
- BIAS IN
- mbus etc.
- OLED | Connectors
- Expansion
- ESP32
- RFM69
- SD card normally conn'd to ESP32 | MBUS
- check transistor part numbers

## Library data of the parts
BOOT_ESP = SparkFun:M02: Header 2 Standard 2-pin 0.1" header. Use with straight break away headers (SKU : PRT-00116), right angle break away headers (PRT-00553), swiss pins (PRT-00743), machine pins (PRT-00117), and female headers (PRT-00115). Molex polarized connector foot print use with SKU : PRT-08233 with associated crimp pins and housings.
BOOT_STM CANBUS UART1 = con-lstb-db:MA02-1: PIN HEADER
C1-C6 C8 C16 C17 C19 C22 C26 C28 C34 C37 C38 C40-C42 C45-C48 = resistor:C-EU: CAPACITOR, European symbol
C7 C9-C15 C18 C20 C21 C23-C25 C27 C29-C33 C35 C36 C39 C43 C44 C49 C50 CF1-CF9 CV1-CV3 = rcl:C-EU: CAPACITOR, European symbol; SPICEPREFIX: C
CT1-CT9 = sj-3523-smt:SJ-3523-SMT: 3.5mm Stereo Jack SMT; MPN: SJ-3523-SMT
D1-D21 D24-D37 D40*1 = microbuilder:DIODE: Diode SMA Model Volts Amps Type Vf Vr Digikey # Notes SSA34-E3 40V 3A Schottky 480mV @ 3A 200uA @ 40V SSA34-E3/61TGITR-ND CDBA120-G 20V 1A Schottky 500mV @ 1A 500uA @ 20V 641-1014-6-ND REEL MBRA210 10V 2A Schottky 350mV @ 2A 700uA @ 10V MBRA210LT3 SOD-123 Model Volts Amps Type Vf Vr Order # Notes BAT54T1G 30V 200mA Schottky 800mV @ 200mA 2uA @ 25V BAT54T1GOSTR-ND B0530W 30V 500mA Schottky 430mV @ 500mA 130uA @ 30V B0530W-FDICT-ND REEL MBR120 1A 20V Schottky 340mV @ 1A MBR120VLSFT1GOSCT-ND SOD-323 Model Volts Amps Type Vf Vr Order # Notes PMEG2005EJ 20V 500mA Schottky 355mV @ 500mA 568-4110-1-ND ZLLS410 10V 570mA Schottky 380mV @ 570mA ZLLS410CT-ND 1N4148WS 75V 150mA Silicon/Simple 1V 1N4148WSFSCT-ND REEL SOD-523 Model Volts Amps Type Vf Vr Order # Notes BAT54XV2 30V 200mA Schottky 0.8V @ 100mA BAT54XV2CT-ND TB751S 30V 30mA Schottky RB751S-40TE61CT-ND SOT23-R/W (R = Solder Paste/Reflow Ovens, W = Hand-Soldering) Model Volts Amps Type Vf Vr Order # Notes BAT54FILM 40V 300mA Schottky 497-7162-1-ND
EXPANSION = pinhead+:PINHD-2X13: PIN HEADER
FB1 FB2 = microbuilder:FERRITE: Ferrite Bead 0603 MMZ1608B121C - 120 Ohm @ 100MHz, 600mA, 0.15 Ohm DC Resistance - Digikey: 445-2164-1-ND BK1608HW121-T - 120 Ohm, 600mA Ferrite Chip - Digikey: 587-1876-2-ND 0805 HZ0805B272R-10 - 2.7K Ohm @ 100MHz, 200mA, 0.8 Ohm DC Resistance - Digikey: 240-2504-1-ND (see also Murata BLM21BD272SN1L) MMZ2012Y152B - 1.5K Ohm @ 100MHz, 500mA, 0.4 Ohm DC Resistance - Digikey: 445-1560-1-ND - Mainly for high frequency (80-400MHz) MMZ2012R102A - 1K Ohm @ 100MHz, 500mA, 0.3 Ohm DC Resistance - Digikey: 445-1555-2-ND - More general purpose (10-200MHz); MPN: MH1608-601Y
FB3-FB9 = microbuilder:FERRITE: Ferrite Bead 0603 MMZ1608B121C - 120 Ohm @ 100MHz, 600mA, 0.15 Ohm DC Resistance - Digikey: 445-2164-1-ND BK1608HW121-T - 120 Ohm, 600mA Ferrite Chip - Digikey: 587-1876-2-ND 0805 HZ0805B272R-10 - 2.7K Ohm @ 100MHz, 200mA, 0.8 Ohm DC Resistance - Digikey: 240-2504-1-ND (see also Murata BLM21BD272SN1L) MMZ2012Y152B - 1.5K Ohm @ 100MHz, 500mA, 0.4 Ohm DC Resistance - Digikey: 445-1560-1-ND - Mainly for high frequency (80-400MHz) MMZ2012R102A - 1K Ohm @ 100MHz, 500mA, 0.3 Ohm DC Resistance - Digikey: 445-1555-2-ND - More general purpose (10-200MHz); MPN: BLM18BD252SN1D
G1 = CH291-1220LF:CH291-1220LF: Battery Holder, SMT, 12mm multicomp PART NO. CH291-1220LF Source: Data sheet <http://www.farnell.com/datasheets/1505860.pdf>; AVAILABILITY: Unavailable; DESCRIPTION: BATTERY HOLDER, SMT, 12MM; Accessory Type: Coin Cell Battery Holder; For Use With: 1220 Coin Cell Batteries; Battery ...; MF: Multicomp; MP: CH291-1220LF; PACKAGE: None; PRICE: None
J1 SJ3 SJ5-SJ7 SJ14 SJ20 SJ21 SJ23 SJ25-SJ27 SJ32 SJ35-SJ37 = SparkFun:SOLDERJUMPER: Solder Jumper Standard SMD solder jumper. Used to automate production. Two varients : Normally Open and Normally Closed are the same, but have different paste layers. NC will have a large amount of paste and should jumper during reflow.
J$1 = SparkFun-Connectors:SMA_EDGE: SMA Antenna Connector End launch SMA connector. The paste layer has been removed so that the connector can be hand soldered onto the board after reflow.
JP1 JP4 = SparkFun-Jumpers:JUMPER-SMT_2_NC_TRACE: Normally closed trace jumper This jumper has a trace between two pads so it's normally closed (NC). Use a razor knife to open the connection. For best results follow the IPC guidelines for cutting traces: Cutout at least 0.063 mm (0.005 in). Remove all loose material to clean up the cut area. Seal the cut with an approved epoxy. Reapply solder to reclose the connection.
JP5 JP6 JP9 R3-R5 R9-R12 R14-R19 R24 R28 R30-R36 RB1_ RB1A RB1B RB2_ RB2A RB2B RB3_ RB3A RB3B RB4_ RB4A RB4B RB5_ RB5A RB5B RB6_ RB6A RB6B RB7_ RB7A RB7B RB8_ RB8A RB8B RB9_ RB9A RB9B = rcl:R-EU_: RESISTOR, European symbol; SPICEPREFIX: R
JP10-JP18 SJ4 SJ9 SJ10 SJ13 = SparkFun-Jumpers:JUMPER-SMT_2_NO: Normally open jumper This jumper has two pads in close proximity to each other. Apply solder to close the connection. Round pads are easier to solder for beginners, but are a lot larger. SparkFun Product that uses the round pads: SparkFun EL Sequencer <https://www.sparkfun.com/products/12781>
JP19 = SparkFun-Jumpers:JUMPER-SMT_3_NO: Normally open jumper This jumper has three pads in close proximity to each other. Apply solder to close the connection(s).
LED1-LED4 = adafruit:LED: LED OSRAM: - CHIPLED LG R971, LG N971, LY N971, LG Q971, LY Q971, LO R971, LY R971 LH N974, LH R974 LS Q976, LO Q976, LY Q976 LO Q996 - Hyper CHIPLED LW Q18S LB Q993, LB Q99A, LB R99A - SideLED LS A670, LO A670, LY A670, LG A670, LP A670 LB A673, LV A673, LT A673, LW A673 LH A674 LY A675 LS A676, LA A676, LO A676, LY A676, LW A676 LS A679, LY A679, LG A679 - Hyper Micro SIDELED® LS Y876, LA Y876, LO Y876, LY Y876 LT Y87S - SmartLED LW L88C, LW L88S LB L89C, LB L89S, LG L890 LS L89K, LO L89K, LY L89K LS L896, LA L896, LO L896, LY L896 - TOPLED LS T670, LO T670, LY T670, LG T670, LP T670 LSG T670, LSP T670, LSY T670, LOP T670, LYG T670 LG T671, LOG T671, LSG T671 LB T673, LV T673, LT T673, LW T673 LH T674 LS T676, LA T676, LO T676, LY T676, LB T676, LH T676, LSB T676, LW T676 LB T67C, LV T67C, LT T67C, LS T67K, LO T67K, LY T67K, LW E67C LS E67B, LA E67B, LO E67B, LY E67B, LB E67C, LV E67C, LT E67C LW T67C LS T679, LY T679, LG T679 LS T770, LO T770, LY T770, LG T770, LP T770 LB T773, LV T773, LT T773, LW T773 LH T774 LS E675, LA E675, LY E675, LS T675 LS T776, LA T776, LO T776, LY T776, LB T776 LHGB T686 LT T68C, LB T68C - Hyper Mini TOPLED® LB M676 - Mini TOPLED Santana® LG M470 LS M47K, LO M47K, LY M47K Source: http://www.osram.convergy.de/
LSE = microbuilder:CRYSTAL: Crystals HC49UP - Surface Mount Crystal 4.0MHz 18pF +/-30ppm Surface Mount Crystal [Digikey: 535-9857-1-ND] 12.0 MHz Surface Mount Crystal [Digikey: 535-9869-6-ND] 25.0 MHz Surface Mount Crystal [Digikey: 535-9078-1-ND] 2.5 x 2.0mm - MEMs SMT Crystal 16.0 MHz 10pF 20ppm 2.5 x 2.0mm Crystal [Digikey -40-85°C: 535-10923-1-ND] 3.2 x 2.5mm - MEMs SMT Crystal 12.0 MHz 8pF 15ppm 3.2 x 2.5mm Crystal [Digikey: -10-70°C: 644-1047-1-ND -40-125°C: 644-1128-1-ND] 16.0 MHz 8pF 15ppm 3.2 x 2.5mm Crystal [Digikey: -10-70°C: 644-1049-1-ND -40-125°C: 644-1129-2-ND] 16.0 MHz 10pF 10ppm 3.2 x 2.5mm Crystal [Digikey: 644-1100-1-ND] 27.12 MHz 18pF 30ppm 3.2 x 2.5mm Crystal [Digikey: 887-1424-1-ND] 27.12MHz 10pF 10ppm 3.2 x 2.5mm Crystal [Digikey: 887-1329-1-ND] 4.9 x 1.8mm - MEMs SMT Crystal 32.768 KHz 12.5pF 20ppm 4.9 x 1.8mm Crystal [Digikey: SE2415CT-ND] 8.0 x 3.8mm - Surface Mount Crystal 32.768kHz 12.5pF 20ppm -40°C-85°C [Digikey: 535-9166-2-ND] Cylinder 32.768KHz Cylinder Crystal (2x6mm body) [Ex. Digikey: 300-8341-2-ND]
MCP1825 MCP1825(ANALOG) = SteelCaveRobotics-Power:MCP1825: MCP1825 3.3v LDO Linear Regulator
OLED = con-lstb-db:MA04-1-OLED: PIN HEADER with OLED footprint.
PCB2 = e14_Rpi3_RevA+mirror-pcb copy:RPI3: Device for Raspberry Pi 3 board created by Dave Young for www.element14.com More information and support community is available at https://www.element14.com/community/community/raspberry-pi Device for Raspberry Pi 3 board updated by Gerald Schwarz for www.element14.com On RPI3 addet the layer milling and created a mirrored shield.; MPN: M20-7872042
PS1 = LT1461AIS8:LT1461AIS8-3.3#PBF: Linear Technology LT1461AIS8-3.3#PBF, Series Voltage Reference 3.3V, 0.04% 20 V max., 8-Pin SOIC Source: Datasheet <http://uk.rs-online.com/web/p/products/7618279P>; DESCRIPTION: Linear Technology LT1461AIS8-3.3#PBF, Series Voltage Reference 3.3V, 0.04% 20 V max., 8-Pin SOIC; HEIGHT: 1.752mm; MANUFACTURER_NAME: Linear Technology; MANUFACTURER_PART_NUMBER: LT1461AIS8-3.3#PBF; MPN: REF196GSZ; RS_PART_NUMBER: 7618279P; RS_PRICE-STOCK: http://uk.rs-online.com/web/p/products/7618279P
Q1 = microbuilder:TRANSISTOR_PNP: PNP Transistor Transistor (PNP) 800mA 60V, 1.6V VCE @ 500mA [Digikey: MMBT2907AFSTR-ND] Transistor (PNP) Low Sat - 1.5A 20V, 260mV VCE @ 400mA [Digikey: ZXTP25020DFLTR-ND] SOT23-R - SOT23 footprint optimised for use with solder paste and reflow ovens. SOT23-W - SOT23 footprint optimised for hand-soldering (larger pads).; MPN: SMMBT3906LT1G
Q2 Q3 = microbuilder:TRANSISTOR_NPN: NPN Transistor Transistor (NPN) 500mA 45V - BC817 [Digikey: 568-1631-1-ND] Transistor (NPN) 500mA 45V - BC817,215 [Mouser: 771-BC817-T/R] SOT23-R - SOT23 footprint optimised for use with solder paste and reflow ovens. SOT23-W - SOT23 footprint optimised for hand-soldering (larger pads).; MPN: KST3904MTF
R1 R2 R6-R8 R13 R20-R23 R25-R27 R37 R38 R41-R43 R51-R53 RF1-RF9 = resistor:R-EU_: RESISTOR, European symbol
RFM69HCW = rfm12b _ rfm69cw:RFM12_SMD: RFM12 is a low costing ISM band transceiver module implemented with unique PLL. It works signal ranges from 315/433/868/915MHZ bands, comply with FCC, ETSI regulation. The SPI interface is used to communicate with microcontroller for parameter setting.
RJ1 RJ2 = 95501-6889 rj45 smt:95501-6889: Molex Cat3 8-Way Female RJ45 Connector Right Angle Surface Mount Unshielded Source: Datasheet <https://www.molex.com/pdm_docs/sd/955016889_sd.pdf>; ALLIED_NUMBER: 70372913; ALLIED_PRICE-STOCK: https://www.alliedelec.com/molex-incorporated-95501-6889/70372913/; DESCRIPTION: Molex Cat3 8-Way Female RJ45 Connector Right Angle Surface Mount Unshielded; HEIGHT: 11.5mm; MANUFACTURER_NAME: Molex; MANUFACTURER_PART_NUMBER: 95501-6889; MOUSER_PART_NUMBER: 538-95501-6889; MOUSER_PRICE-STOCK: https://www.mouser.com/Search/Refine.aspx?Keyword=538-95501-6889; RS_PART_NUMBER: 3862738; RS_PRICE-STOCK: http://uk.rs-online.com/web/p/products/3862738
S1 = switch-omron:31-XX: OMRON SWITCH; MPN: B3F-3100; OC_FARNELL: 959704; OC_NEWARK: 36M3582
S2 = KSS221GLFS:KSS221GLFS: IP40 Side Tactile Switch, SPST-NO 50 mA Source: Datasheet <http://uk.rs-online.com/web/p/products/7931689P>; DESCRIPTION: IP40 Side Tactile Switch, SPST-NO 50 mA; HEIGHT: mm; MANUFACTURER_NAME: C & K COMPONENTS; MANUFACTURER_PART_NUMBER: KSS221GLFS; RS_PART_NUMBER: 7931689P; RS_PRICE-STOCK: http://uk.rs-online.com/web/p/products/7931689P
STM32F303VE = stm32f303:STM32F303XB
SV1 SV2 UART_STM = con-lstb-db:MA06-1: PIN HEADER; OC_FARNELL: unknown; OC_NEWARK: unknown
SV3 = con-lstb-db:MA03-1: PIN HEADER; OC_FARNELL: unknown; OC_NEWARK: unknown
TB2 TERM1 TERM3 = 3.5mm terminal block rs pro:3.5MM_TB_X6
TP4 TP5 TP7 TP9 TP10 TP18-TP20 = SparkFun-Connectors:TEST-POINT: SparkFun Test Points Bare copper test points for troubleshooting or In-Circuit-Testing. These are used by our Production team for verifying production board runs using pogo-pins on test beds. SparkFun Products: SparkFun LSM9DS1 Breakout <https://www.sparkfun.com/products/13284> SparkFun PSOC <https://www.sparkfun.com/products/13714> SparkFun Load Cell Amplifier <https://www.sparkfun.com/products/13879>
U1 = ESP32-WROOM-32D:ESP32-WROOM-32D: IC: SoC; GPIO, I2C, I2S, IR, SD, SDIO, SPI, UART; 2.7÷3.6VDC; 20dBm; AVAILABILITY: Unavailable; DESCRIPTION: IC: SoC; GPIO, I2C, I2S, IR, SD, SDIO, SPI, UART; 2.7÷3.6VDC; 20dBm; MF: Espressif Systems; MP: ESP32-WROOM-32D; PACKAGE: Module Espressif Systems; PRICE: None
U$2 = BOOST MODULE CN6009:BOOST_MODULE
U$7 = MOLEX 47219-2001:47219-2001_MICROSD
USB-C = CSP-USC16-TR:CSP-USC16-TR: CSP-USC16-TR TOBY.CO.UK; MPN: CSP-USC16-TR
VT1 = adafruit:2.1MMJACK: 2.1mm x 5.5mm THM DC jack with internal switch. Digikey part #PJ-102A, 4UCON part #05537 2.1mm x 5.5mm SMT DC jack with internal switch. Digikey part #PJ-002A-SMT, 4UCON part #03267 By microbuilder.eu & adafruit.com; MPN: ADC-028-1-T
Y1 = 6mm 3m5mm crystal multicomp pro abracon:6MM_3.5MM_CRYSTAL: Abracon 12MHz Crystal Unit +/-20ppm SMD 4-Pin 6 x 3.6 x 1.2mm Source: Datasheet <http://uk.rs-online.com/web/p/products/1712778P>; DESCRIPTION: Abracon 12MHz Crystal Unit +/-20ppm SMD 4-Pin 6 x 3.6 x 1.2mm; HEIGHT: mm; MANUFACTURER_NAME: ABRACON; MANUFACTURER_PART_NUMBER: ABMM2-12.000MHZ-E2-T; RS_PART_NUMBER: 1712778P; RS_PRICE-STOCK: http://uk.rs-online.com/web/p/products/1712778P

## Net classes
0 default: width 0.178 mm, drill 0.5 mm, clearance 0.152 mm
1 power: width 0.254 mm, drill 0.5 mm, clearance 0.152 mm
2 gnd: width 0.254 mm, drill 0.5 mm, clearance 0.152 mm
3 ant: width 0.406 mm, drill 0.5 mm, clearance 0.254 mm
4 cts_vts: width 0.254 mm, drill 0.5 mm, clearance 0.229 mm